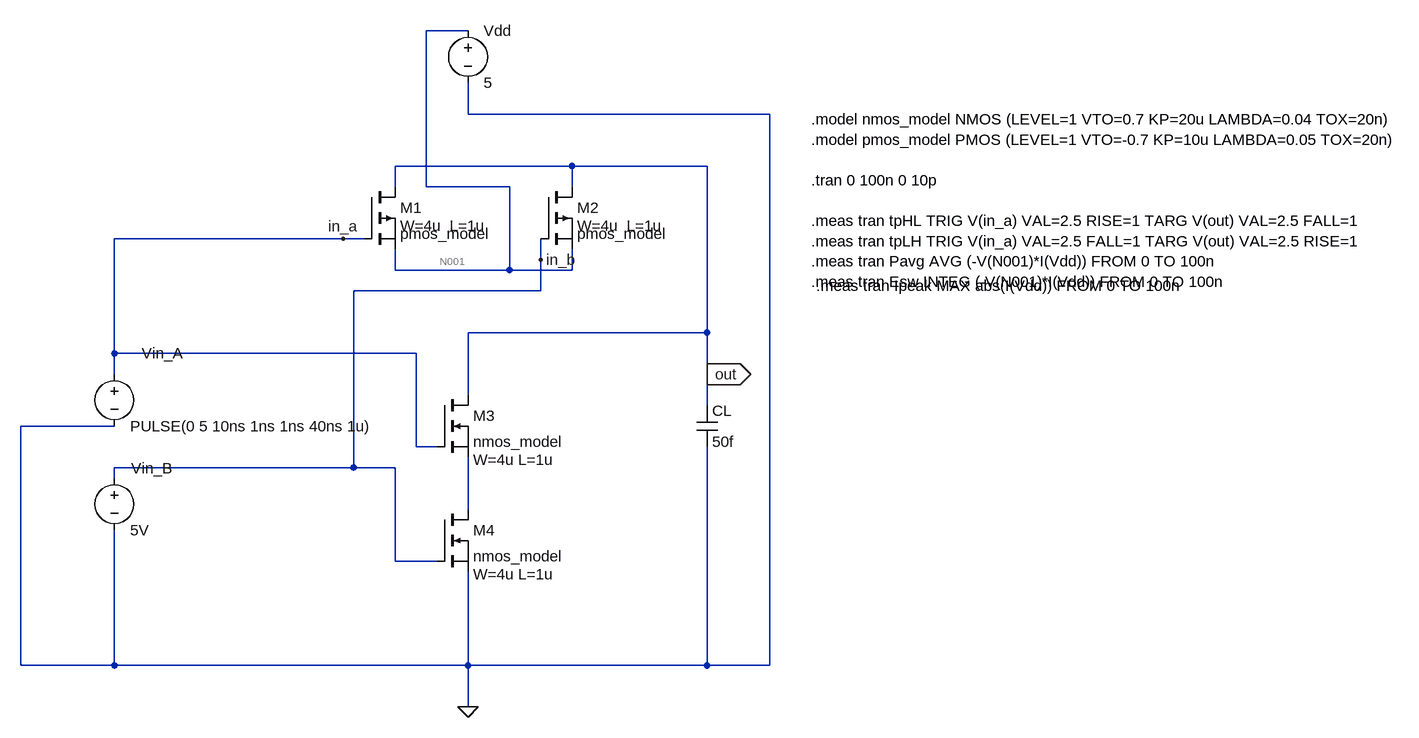
[diagram p0: schematic cmos_nand2.asc]
cmos_nand2.asc, the LTspice schematic file:
Version 4.1
SHEET 1 1888 772
WIRE 368 -288 304 -288
WIRE 368 -160 368 -208
WIRE 832 -160 368 -160
WIRE 528 -80 256 -80
WIRE 736 -80 528 -80
WIRE 256 -48 256 -80
WIRE 304 -48 304 -288
WIRE 432 -48 304 -48
WIRE 528 -48 528 -80
WIRE 176 32 -176 32
WIRE 208 32 176 32
WIRE 480 64 480 32
WIRE 256 80 256 48
WIRE 432 80 432 -48
WIRE 432 80 256 80
WIRE 528 80 528 48
WIRE 528 80 432 80
WIRE 480 112 480 64
WIRE 480 112 192 112
WIRE 736 176 736 -80
WIRE 736 176 368 176
WIRE -176 208 -176 32
WIRE 288 208 -176 208
WIRE -176 240 -176 208
WIRE 736 240 736 176
WIRE 368 272 368 176
WIRE 736 288 736 240
WIRE -176 320 -320 320
WIRE 288 352 288 208
WIRE 320 352 288 352
WIRE 192 384 192 112
WIRE 192 384 -176 384
WIRE 256 384 192 384
WIRE -176 400 -176 384
WIRE 368 448 368 368
WIRE 256 528 256 384
WIRE 320 528 256 528
WIRE -320 688 -320 320
WIRE -176 688 -176 480
WIRE -176 688 -320 688
WIRE 368 688 368 544
WIRE 368 688 -176 688
WIRE 736 688 736 352
WIRE 736 688 368 688
WIRE 832 688 832 -160
WIRE 832 688 736 688
WIRE 368 752 368 688
FLAG 368 752 0
FLAG 176 32 in_a
FLAG 480 64 in_b
FLAG 736 240 out
IOPIN 736 240 Out
SYMBOL voltage 368 -304 R0
WINDOW 123 0 0 Left 0
WINDOW 39 0 0 Left 0
SYMATTR InstName Vdd
SYMATTR Value 5
SYMBOL voltage -176 224 R0
WINDOW 123 0 0 Left 0
WINDOW 39 0 0 Left 0
WINDOW 0 42 -16 Left 2
SYMATTR InstName Vin_A
SYMATTR Value PULSE(0 5 10ns 1ns 1ns 40ns 1u)
SYMBOL voltage -176 384 R0
WINDOW 123 0 0 Left 0
WINDOW 39 0 0 Left 0
WINDOW 0 26 1 Left 2
SYMATTR InstName Vin_B
SYMATTR Value 5V
SYMBOL cap 720 288 R0
SYMATTR InstName CL
SYMATTR Value 50f
SYMBOL pmos 208 -48 R0
WINDOW 39 56 60 Left 2
SYMATTR SpiceLine W=4u  L=1u
SYMATTR InstName M1
SYMATTR Value pmos_model
SYMBOL pmos 480 -48 R0
WINDOW 39 56 60 Left 2
SYMATTR SpiceLine W=4u  L=1u
SYMATTR InstName M2
SYMATTR Value pmos_model
SYMBOL nmos 320 272 R0
WINDOW 39 56 100 Left 2
SYMATTR SpiceLine W=4u L=1u
SYMATTR InstName M3
SYMATTR Value nmos_model
SYMBOL nmos 320 448 R0
WINDOW 39 56 100 Left 2
SYMATTR SpiceLine W=4u L=1u
SYMATTR InstName M4
SYMATTR Value nmos_model
TEXT 896 -152 Left 2 !.model nmos_model NMOS (LEVEL=1 VTO=0.7 KP=20u LAMBDA=0.04 TOX=20n)\n.model pmos_model PMOS (LEVEL=1 VTO=-0.7 KP=10u LAMBDA=0.05 TOX=20n)\n \n.tran 0 100n 0 10p\n \n.meas tran tpHL TRIG V(in_a) VAL=2.5 RISE=1 TARG V(out) VAL=2.5 FALL=1\n.meas tran tpLH TRIG V(in_a) VAL=2.5 FALL=1 TARG V(out) VAL=2.5 RISE=1\n.meas tran Pavg AVG (-V(N001)*I(Vdd)) FROM 0 TO 100n\n.meas tran Esw INTEG (-V(N001)*I(Vdd)) FROM 0 TO 100n
TEXT 904 104 Left 2 !.meas tran Ipeak MAX abs(I(Vdd)) FROM 0 TO 100n

The netlist it stands for:
* cmos_nand2.asc
Vdd N001 0 5
Vin_A in_a 0 PULSE(0 5 10ns 1ns 1ns 40ns 1u)
Vin_B in_b 0 5V
CL out 0 50f
M1 out in_a N001 N001 pmos_model W=4u  L=1u
M2 out in_b N001 N001 pmos_model W=4u  L=1u
M3 out in_a N002 N002 nmos_model W=4u L=1u
M4 N002 in_b 0 0 nmos_model W=4u L=1u
.model NMOS NMOS
.model PMOS PMOS
.lib standard.mos
.model nmos_model NMOS (LEVEL=1 VTO=0.7 KP=20u LAMBDA=0.04 TOX=20n)
.model pmos_model PMOS (LEVEL=1 VTO=-0.7 KP=10u LAMBDA=0.05 TOX=20n)
.tran 0 100n 0 10p
.meas tran tpHL TRIG V(in_a) VAL=2.5 RISE=1 TARG V(out) VAL=2.5 FALL=1
.meas tran tpLH TRIG V(in_a) VAL=2.5 FALL=1 TARG V(out) VAL=2.5 RISE=1
.meas tran Pavg AVG (-V(N001)*I(Vdd)) FROM 0 TO 100n
.meas tran Esw INTEG (-V(N001)*I(Vdd)) FROM 0 TO 100n
.meas tran Ipeak MAX abs(I(Vdd)) FROM 0 TO 100n
.backanno
.end